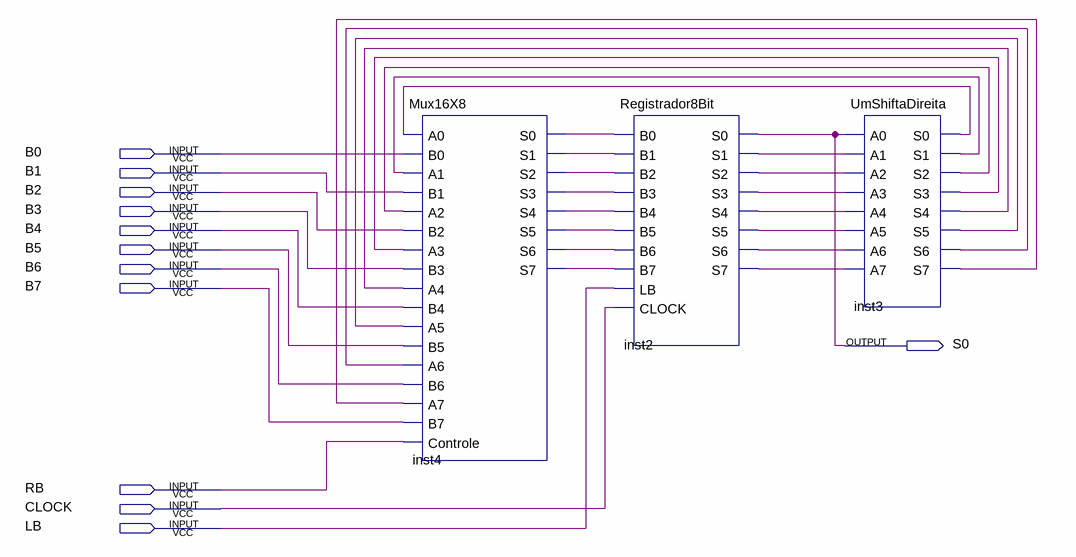
[diagram p0: schematic sheet]
// Quartus schematic CircuitodeB.bdf as structural Verilog: 3 symbols, 12 pins
module CircuitodeB (
  input  B0,
  input  B1,
  input  B2,
  input  B3,
  input  B4,
  input  B5,
  input  B6,
  input  B7,
  input  RB,
  input  CLOCK,
  input  LB,
  output S0
);

  wire inst2_s1, inst2_s2, inst2_s3, inst2_s4, inst2_s5, inst2_s6, inst2_s7, inst3_s0, inst3_s1, inst3_s2,
       inst3_s3, inst3_s4, inst3_s5, inst3_s6, inst3_s7, inst4_s0, inst4_s1, inst4_s2, inst4_s3, inst4_s4,
       inst4_s5, inst4_s6, inst4_s7;

  Mux16X8 inst4 (
    .A0(inst3_s0), .B0(B0), .A1(inst3_s1), .B1(B1), .A2(inst3_s2), .B2(B2), .A3(inst3_s3), .B3(B3),
    .A4(inst3_s4), .B4(B4), .A5(inst3_s5), .B5(B5), .A6(inst3_s6), .B6(B6), .A7(inst3_s7), .B7(B7),
    .Controle(RB), .S0(inst4_s0), .S1(inst4_s1), .S2(inst4_s2), .S3(inst4_s3), .S4(inst4_s4), .S5(inst4_s5),
    .S6(inst4_s6), .S7(inst4_s7));
  Registrador8Bit inst2 (
    .B0(inst4_s0), .B1(inst4_s1), .B2(inst4_s2), .B3(inst4_s3), .B4(inst4_s4), .B5(inst4_s5), .B6(inst4_s6),
    .B7(inst4_s7), .LB(LB), .CLOCK(CLOCK), .S0(S0), .S1(inst2_s1), .S2(inst2_s2), .S3(inst2_s3),
    .S4(inst2_s4), .S5(inst2_s5), .S6(inst2_s6), .S7(inst2_s7));
  UmShiftaDireita inst3 (
    .A0(S0), .A1(inst2_s1), .A2(inst2_s2), .A3(inst2_s3), .A4(inst2_s4), .A5(inst2_s5), .A6(inst2_s6),
    .A7(inst2_s7), .S0(inst3_s0), .S1(inst3_s1), .S2(inst3_s2), .S3(inst3_s3), .S4(inst3_s4), .S5(inst3_s5),
    .S6(inst3_s6), .S7(inst3_s7));
endmodule
